# Altium schematic sheet LED.SchDoc
size A4; SheetNumber: 3; SheetTotal: 7
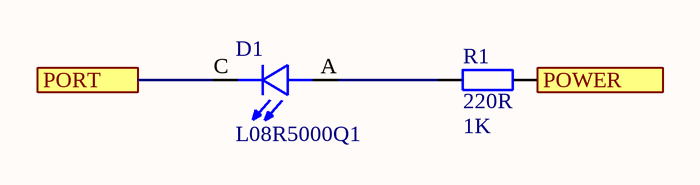
[diagram p0: LED.SchDoc]

## Parts
D1  L08R5000Q1  [LEDRD254W57D500H1070]
R1  220R  value 1K  [AXIAL-0.4]

## Ports
PORT, POWER

## Nets
PORT: D1.C ; port PORT
POWER: R1.2 ; port POWER
NetD1_A: D1.A R1.1

## Library data of the parts
D1 = L08R5000Q1: LED, 5MM, ORANGE; LED / Lamp Size: 5mm / T-1 3/4; LED Colour: Orange; Typ Luminous Intensity: 4.3mcd; Viewing Angle: ...; MF: LED Technology; Value: *; SnapEDA_Link: https://www.snapeda.com/parts/L08R5000Q1/LED+Technology/view-part/?ref=snap; MP: L08R5000Q1; Check_prices: https://www.snapeda.com/parts/L08R5000Q1/LED+Technology/view-part/?ref=eda; Availability: In Stock; Price: None; Package: None
R1 = Res2: Resistor; Published: 8-Jun-2000; LatestRevisionDate: 17-Jul-2002; LatestRevisionNote: Re-released for DXP Platform.; PackageReference: AXIAL-0.4; Publisher: Altium Limited; PackageDescription: Axial Device, Thru-Hole; 2 Leads; 0.4 in Pin Spacing